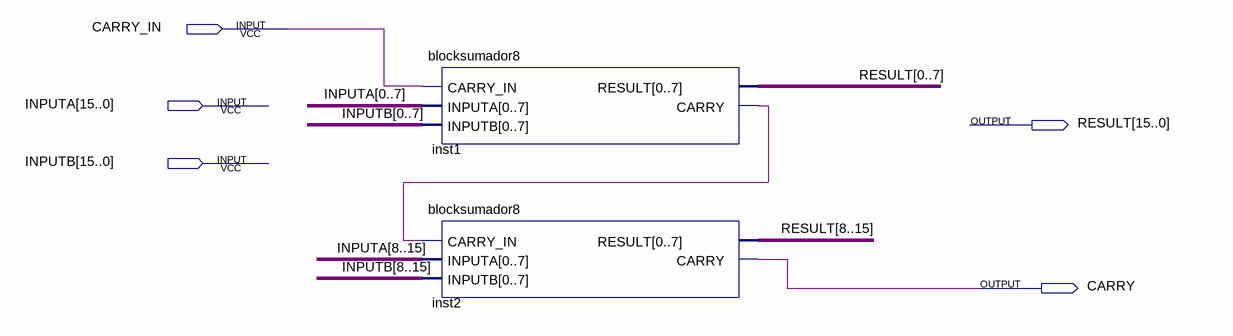
[diagram p0: schematic sheet]
// Quartus schematic Blocksumador16.bdf as structural Verilog: 2 symbols, 5 pins
module Blocksumador16 (
  input  CARRY_IN,
  input  [15:0] INPUTA,
  input  [15:0] INPUTB,
  output [15:0] RESULT,
  output CARRY
);

  wire inst1_carry;

  blocksumador8 inst1 (
    .CARRY_IN(CARRY_IN),
    .INPUTA({INPUTA[0], INPUTA[1], INPUTA[2], INPUTA[3], INPUTA[4], INPUTA[5], INPUTA[6], INPUTA[7]}),
    .INPUTB({INPUTB[0], INPUTB[1], INPUTB[2], INPUTB[3], INPUTB[4], INPUTB[5], INPUTB[6], INPUTB[7]}),
    .RESULT({RESULT[0], RESULT[1], RESULT[2], RESULT[3], RESULT[4], RESULT[5], RESULT[6], RESULT[7]}),
    .CARRY(inst1_carry));
  blocksumador8 inst2 (
    .CARRY_IN(inst1_carry),
    .INPUTA({INPUTA[8], INPUTA[9], INPUTA[10], INPUTA[11], INPUTA[12], INPUTA[13], INPUTA[14], INPUTA[15]}),
    .INPUTB({INPUTB[8], INPUTB[9], INPUTB[10], INPUTB[11], INPUTB[12], INPUTB[13], INPUTB[14], INPUTB[15]}),
    .RESULT({RESULT[8], RESULT[9], RESULT[10], RESULT[11], RESULT[12], RESULT[13], RESULT[14], RESULT[15]}),
    .CARRY(CARRY));
endmodule
